# Altium schematic sheet ICSP INPUT.SchDoc
size A
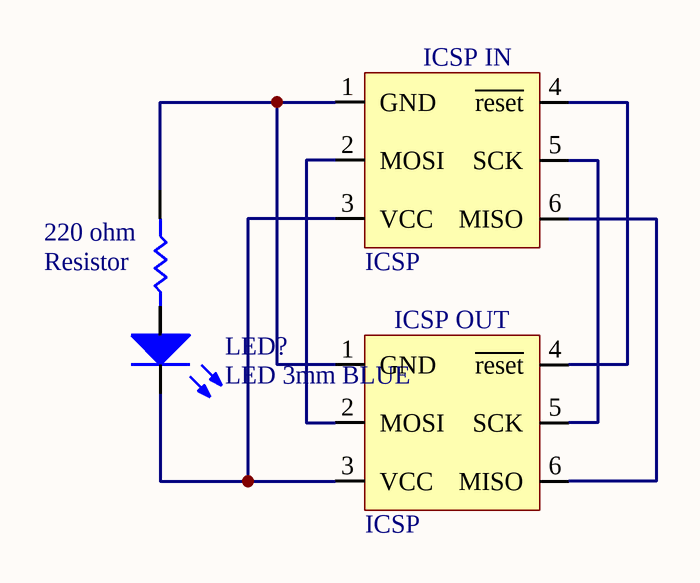
[diagram p0: ICSP INPUT.SchDoc]

## Parts
220_ohm  Resistor  [Resistor]
ICSP_IN  ICSP  [ICSP]
ICSP_OUT  ICSP  [ICSP]
LED?  LED 3mm BLUE  [LED 3mm BLUE]

## Nets
Net220_ohm_1: 220_ohm.1 ICSP_IN.1(GND) ICSP_OUT.1(GND)
Net220_ohm_2: 220_ohm.2 LED?.1(+)
NetICSP_IN_2: ICSP_IN.2(MOSI) ICSP_OUT.2(MOSI)
NetICSP_IN_3: ICSP_IN.3(VCC) ICSP_OUT.3(VCC) LED?.2(-)
NetICSP_IN_4: ICSP_IN.4(~{reset}) ICSP_OUT.4(~{reset})
NetICSP_IN_5: ICSP_IN.5(SCK) ICSP_OUT.5(SCK)
NetICSP_IN_6: ICSP_IN.6(MISO) ICSP_OUT.6(MISO)

## Library data of the parts
ICSP_IN ICSP_OUT = ICSP: Header 6 pin